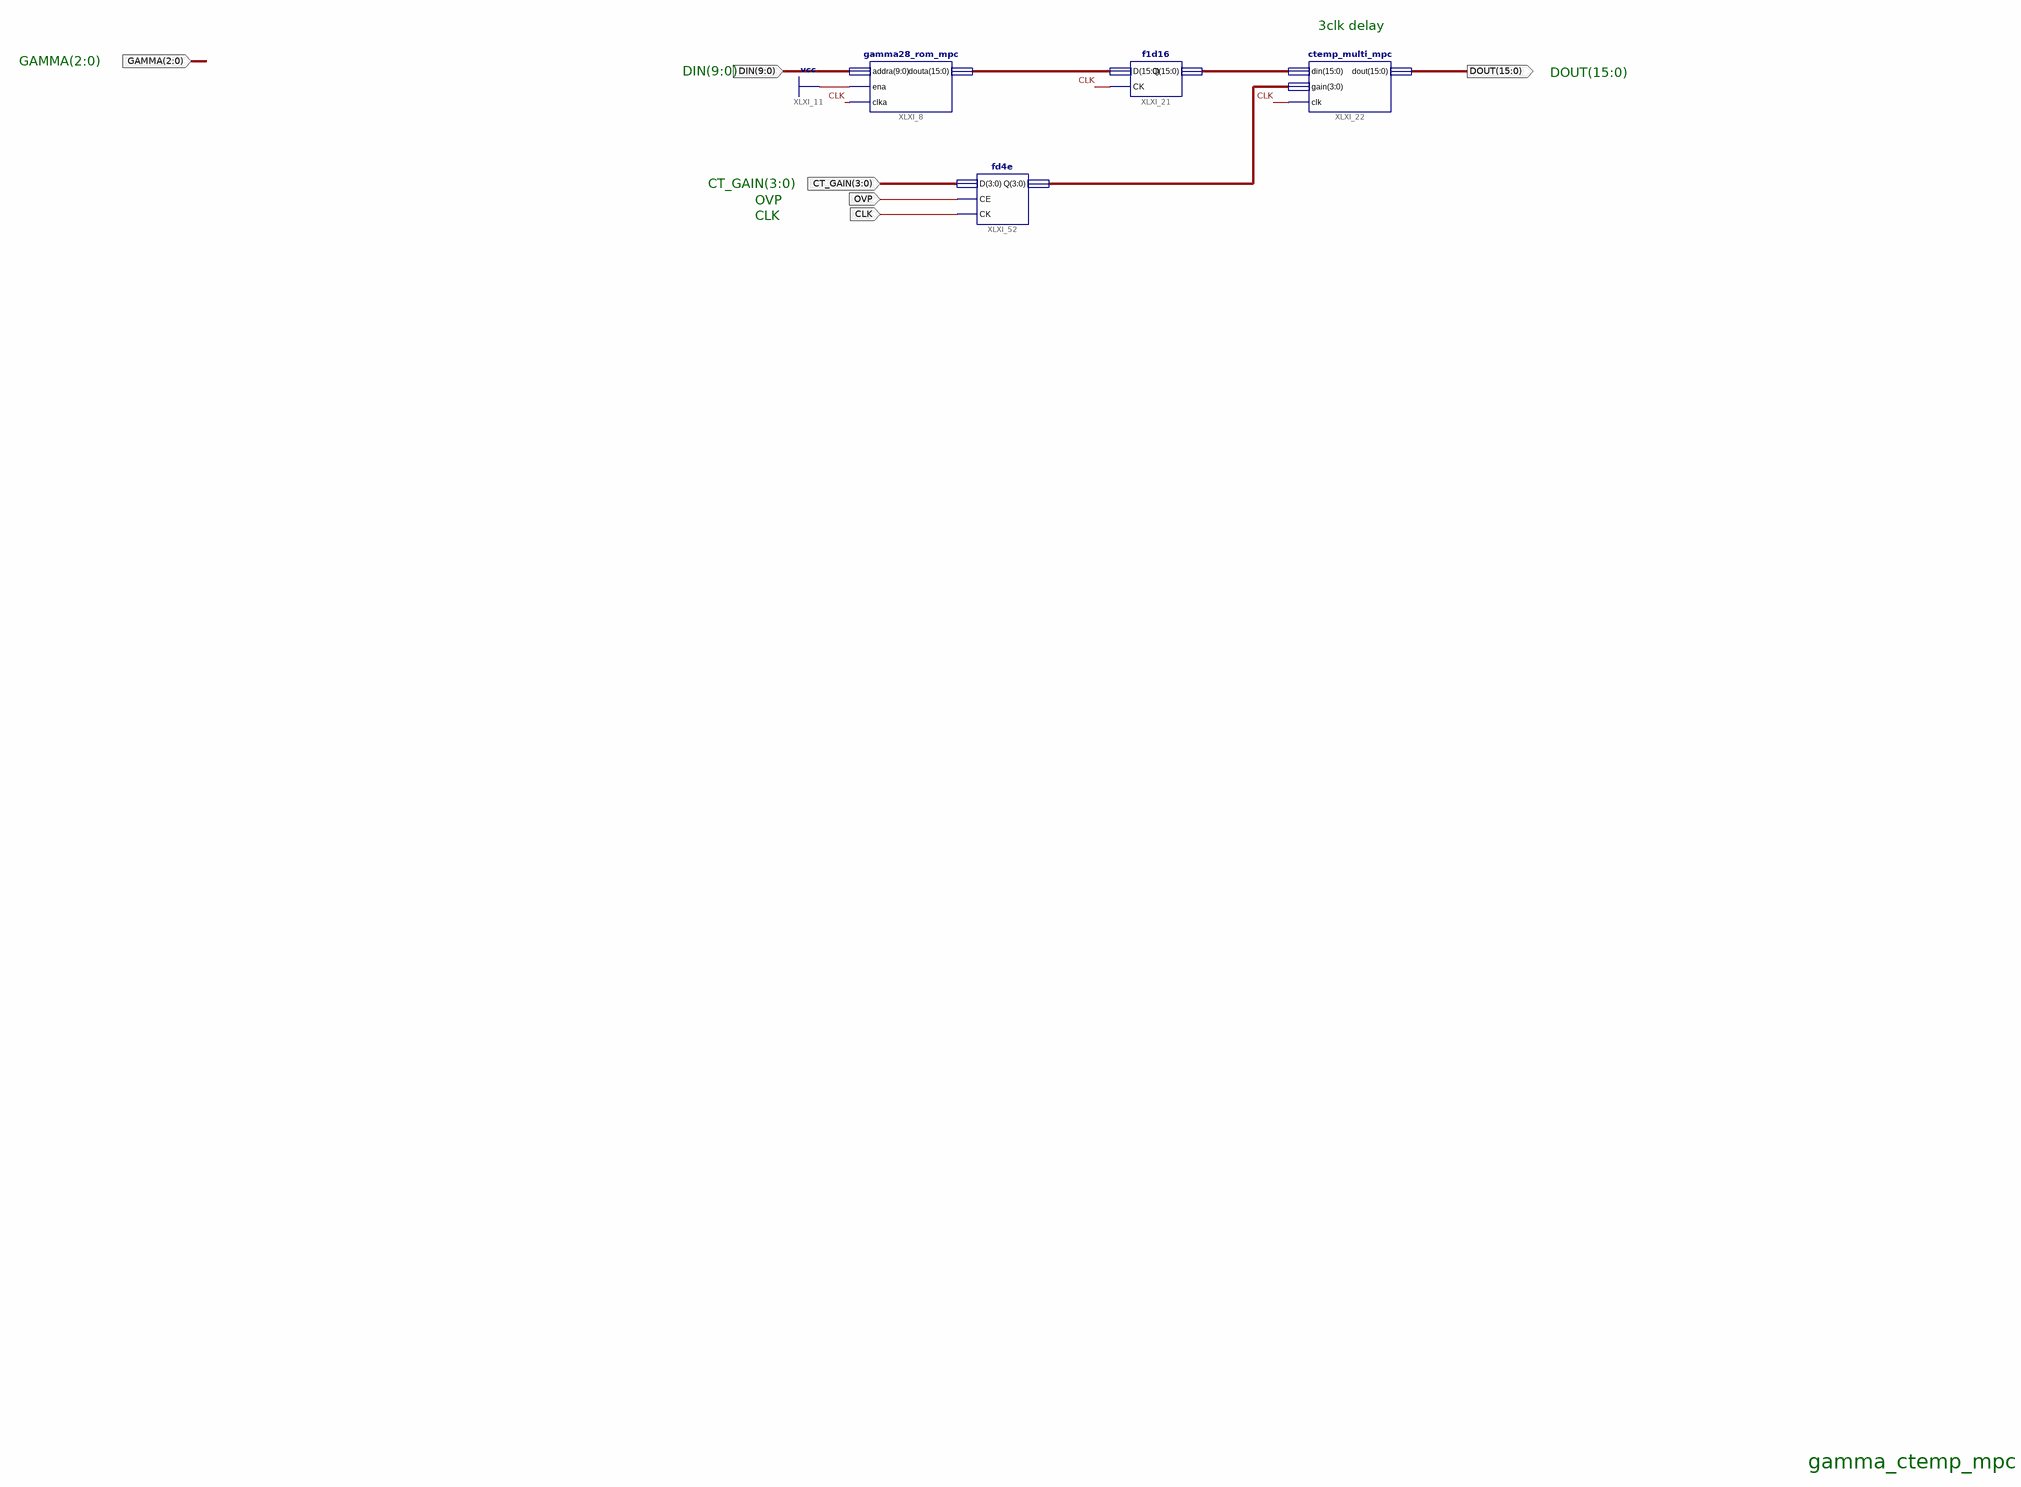
[diagram p0: schematic sheet 1]
// Xilinx ISE schematic gamma_ctemp_mpc.sch (spartan6) as structural Verilog: 4 symbols, 6 ports
module gamma_ctemp_mpc (
  input  CLK,
  input  [9:0] DIN,
  input  [3:0] CT_GAIN,
  input  OVP,
  input  [2:0] GAMMA,
  output [15:0] DOUT
);

  wire [3:0] GAIN;
  wire [15:0] XLXN_61, XLXN_64;

  gamma28_rom_mpc XLXI_8 (.douta(XLXN_61), .clka(CLK), .addra(DIN), .ena(1'b1));
  f1d16 XLXI_21 (.D(XLXN_61), .CK(CLK), .Q(XLXN_64));
  ctemp_multi_mpc XLXI_22 (.din(XLXN_64), .dout(DOUT), .gain(GAIN), .clk(CLK));
  fd4e XLXI_52 (.D(CT_GAIN), .CK(CLK), .CE(OVP), .Q(GAIN));

  // Notes on the sheet:
  //   3clk delay
  //   GAMMA(2:0)
  //   DIN(9:0)
  //   DOUT(15:0)
  //   CT_GAIN(3:0)
  //   OVP
  //   CLK
  //   gamma_ctemp_mpc
endmodule
